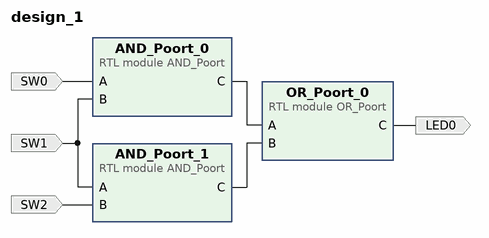
[diagram p0: block diagram of the top level]
# Vivado block design design_1, xc7z020clg400-1, Vivado 2023.1
create_bd_design design_1

create_bd_port -dir I SW0
create_bd_port -dir I SW2
create_bd_port -dir I SW1
create_bd_port -dir O LED0

create_bd_cell -type module -reference AND_Poort AND_Poort_0
create_bd_cell -type module -reference AND_Poort AND_Poort_1
create_bd_cell -type module -reference OR_Poort OR_Poort_0

# ---- connections ----

connect_bd_net [get_bd_pins AND_Poort_0/C] [get_bd_pins OR_Poort_0/A]
connect_bd_net [get_bd_pins AND_Poort_1/C] [get_bd_pins OR_Poort_0/B]
connect_bd_net -net A_0_1 [get_bd_ports SW0] [get_bd_pins AND_Poort_0/A]
connect_bd_net -net A_1_1 [get_bd_ports SW1] [get_bd_pins AND_Poort_1/A] [get_bd_pins AND_Poort_0/B]
connect_bd_net -net B_0_1 [get_bd_ports SW2] [get_bd_pins AND_Poort_1/B]
connect_bd_net [get_bd_pins OR_Poort_0/C] [get_bd_ports LED0]

validate_bd_design
save_bd_design
